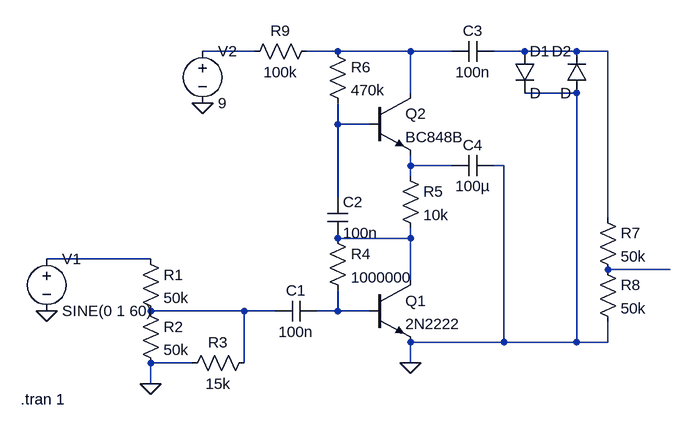
[diagram p0: schematic NazoFuzzCustom.asc]
NazoFuzzCustom.asc, the LTspice schematic file:
Version 4
SHEET 1 1012 680
WIRE 368 -80 288 -80
WIRE 496 -80 448 -80
WIRE 608 -80 496 -80
WIRE 672 -80 608 -80
WIRE 784 -80 736 -80
WIRE 864 -80 784 -80
WIRE 912 -80 864 -80
WIRE 608 -16 608 -80
WIRE 864 -16 784 -16
WIRE 496 32 496 0
WIRE 544 32 496 32
WIRE 608 96 608 80
WIRE 672 96 608 96
WIRE 752 96 736 96
WIRE 608 112 608 96
WIRE 496 144 496 32
WIRE 912 176 912 -80
WIRE 608 208 608 192
WIRE 608 208 496 208
WIRE 208 240 48 240
WIRE 1008 256 912 256
WIRE 608 272 608 208
WIRE 352 320 208 320
WIRE 400 320 352 320
WIRE 496 320 496 288
WIRE 496 320 464 320
WIRE 544 320 496 320
WIRE 752 368 752 96
WIRE 752 368 608 368
WIRE 864 368 864 -16
WIRE 864 368 752 368
WIRE 912 368 912 336
WIRE 912 368 864 368
WIRE 272 400 208 400
WIRE 352 400 352 320
WIRE 608 400 608 368
WIRE 208 432 208 400
FLAG 208 432 0
FLAG 48 320 0
FLAG 288 0 0
FLAG 608 400 0
SYMBOL voltage 48 224 R0
WINDOW 123 0 0 Left 0
WINDOW 39 0 0 Left 0
SYMATTR InstName V1
SYMATTR Value SINE(0 1 60)
SYMBOL voltage 288 -96 R0
SYMATTR InstName V2
SYMATTR Value 9
SYMBOL res 192 224 R0
SYMATTR InstName R1
SYMATTR Value 50k
SYMBOL res 192 304 R0
SYMATTR InstName R2
SYMATTR Value 50k
SYMBOL res 368 384 R90
WINDOW 0 0 56 VBottom 2
WINDOW 3 32 56 VTop 2
SYMATTR InstName R3
SYMATTR Value 15k
SYMBOL cap 464 304 R90
WINDOW 0 0 32 VBottom 2
WINDOW 3 32 32 VTop 2
SYMATTR InstName C1
SYMATTR Value 100n
SYMBOL res 480 192 R0
SYMATTR InstName R4
SYMATTR Value 1000000
SYMBOL npn 544 272 R0
SYMATTR InstName Q1
SYMATTR Value 2N2222
SYMBOL cap 480 144 R0
SYMATTR InstName C2
SYMATTR Value 100n
SYMBOL res 592 96 R0
SYMATTR InstName R5
SYMATTR Value 10k
SYMBOL res 480 -96 R0
SYMATTR InstName R6
SYMATTR Value 470k
SYMBOL cap 736 -96 R90
WINDOW 0 0 32 VBottom 2
WINDOW 3 32 32 VTop 2
SYMATTR InstName C3
SYMATTR Value 100n
SYMBOL cap 736 80 R90
WINDOW 0 0 32 VBottom 2
WINDOW 3 32 32 VTop 2
SYMATTR InstName C4
SYMATTR Value 100µ
SYMBOL diode 768 -80 R0
SYMATTR InstName D1
SYMBOL diode 880 -16 R180
WINDOW 0 24 64 Left 2
WINDOW 3 24 0 Left 2
SYMATTR InstName D2
SYMBOL res 896 160 R0
SYMATTR InstName R7
SYMATTR Value 50k
SYMBOL res 896 240 R0
SYMATTR InstName R8
SYMATTR Value 50k
SYMBOL res 464 -96 R90
WINDOW 0 0 56 VBottom 2
WINDOW 3 32 56 VTop 2
SYMATTR InstName R9
SYMATTR Value 100k
SYMBOL npn 544 -16 R0
SYMATTR InstName Q2
SYMATTR Value BC848B
TEXT 8 456 Left 2 !.tran 1

The netlist it stands for:
* NazoFuzzCustom.asc
V1 N007 0 SINE(0 1 60)
V2 N001 0 9
R1 N007 N009 50k
R2 N009 0 50k
R3 N009 0 15k
C1 N010 N009 100n
R4 N006 N010 1000000
Q1 N006 N010 0 0 2N2222
C2 N004 N006 100n
R5 N005 N006 10k
R6 N002 N004 470k
C3 N003 N002 100n
C4 0 N005 100µ
D1 N003 0 D
D2 0 N003 D
R7 N003 N008 50k
R8 N008 0 50k
R9 N002 N001 100k
Q2 N002 N004 N005 0 BC848B
.model D D
.lib standard.dio
.model NPN NPN
.model PNP PNP
.lib standard.bjt
.tran 1
.backanno
.end